# Altium schematic sheet CW_demcheva_ControlBoard_Sh2.SchDoc: =title_line_1 + title_line_2
size 840 x 594 mm; SheetNumber: 2
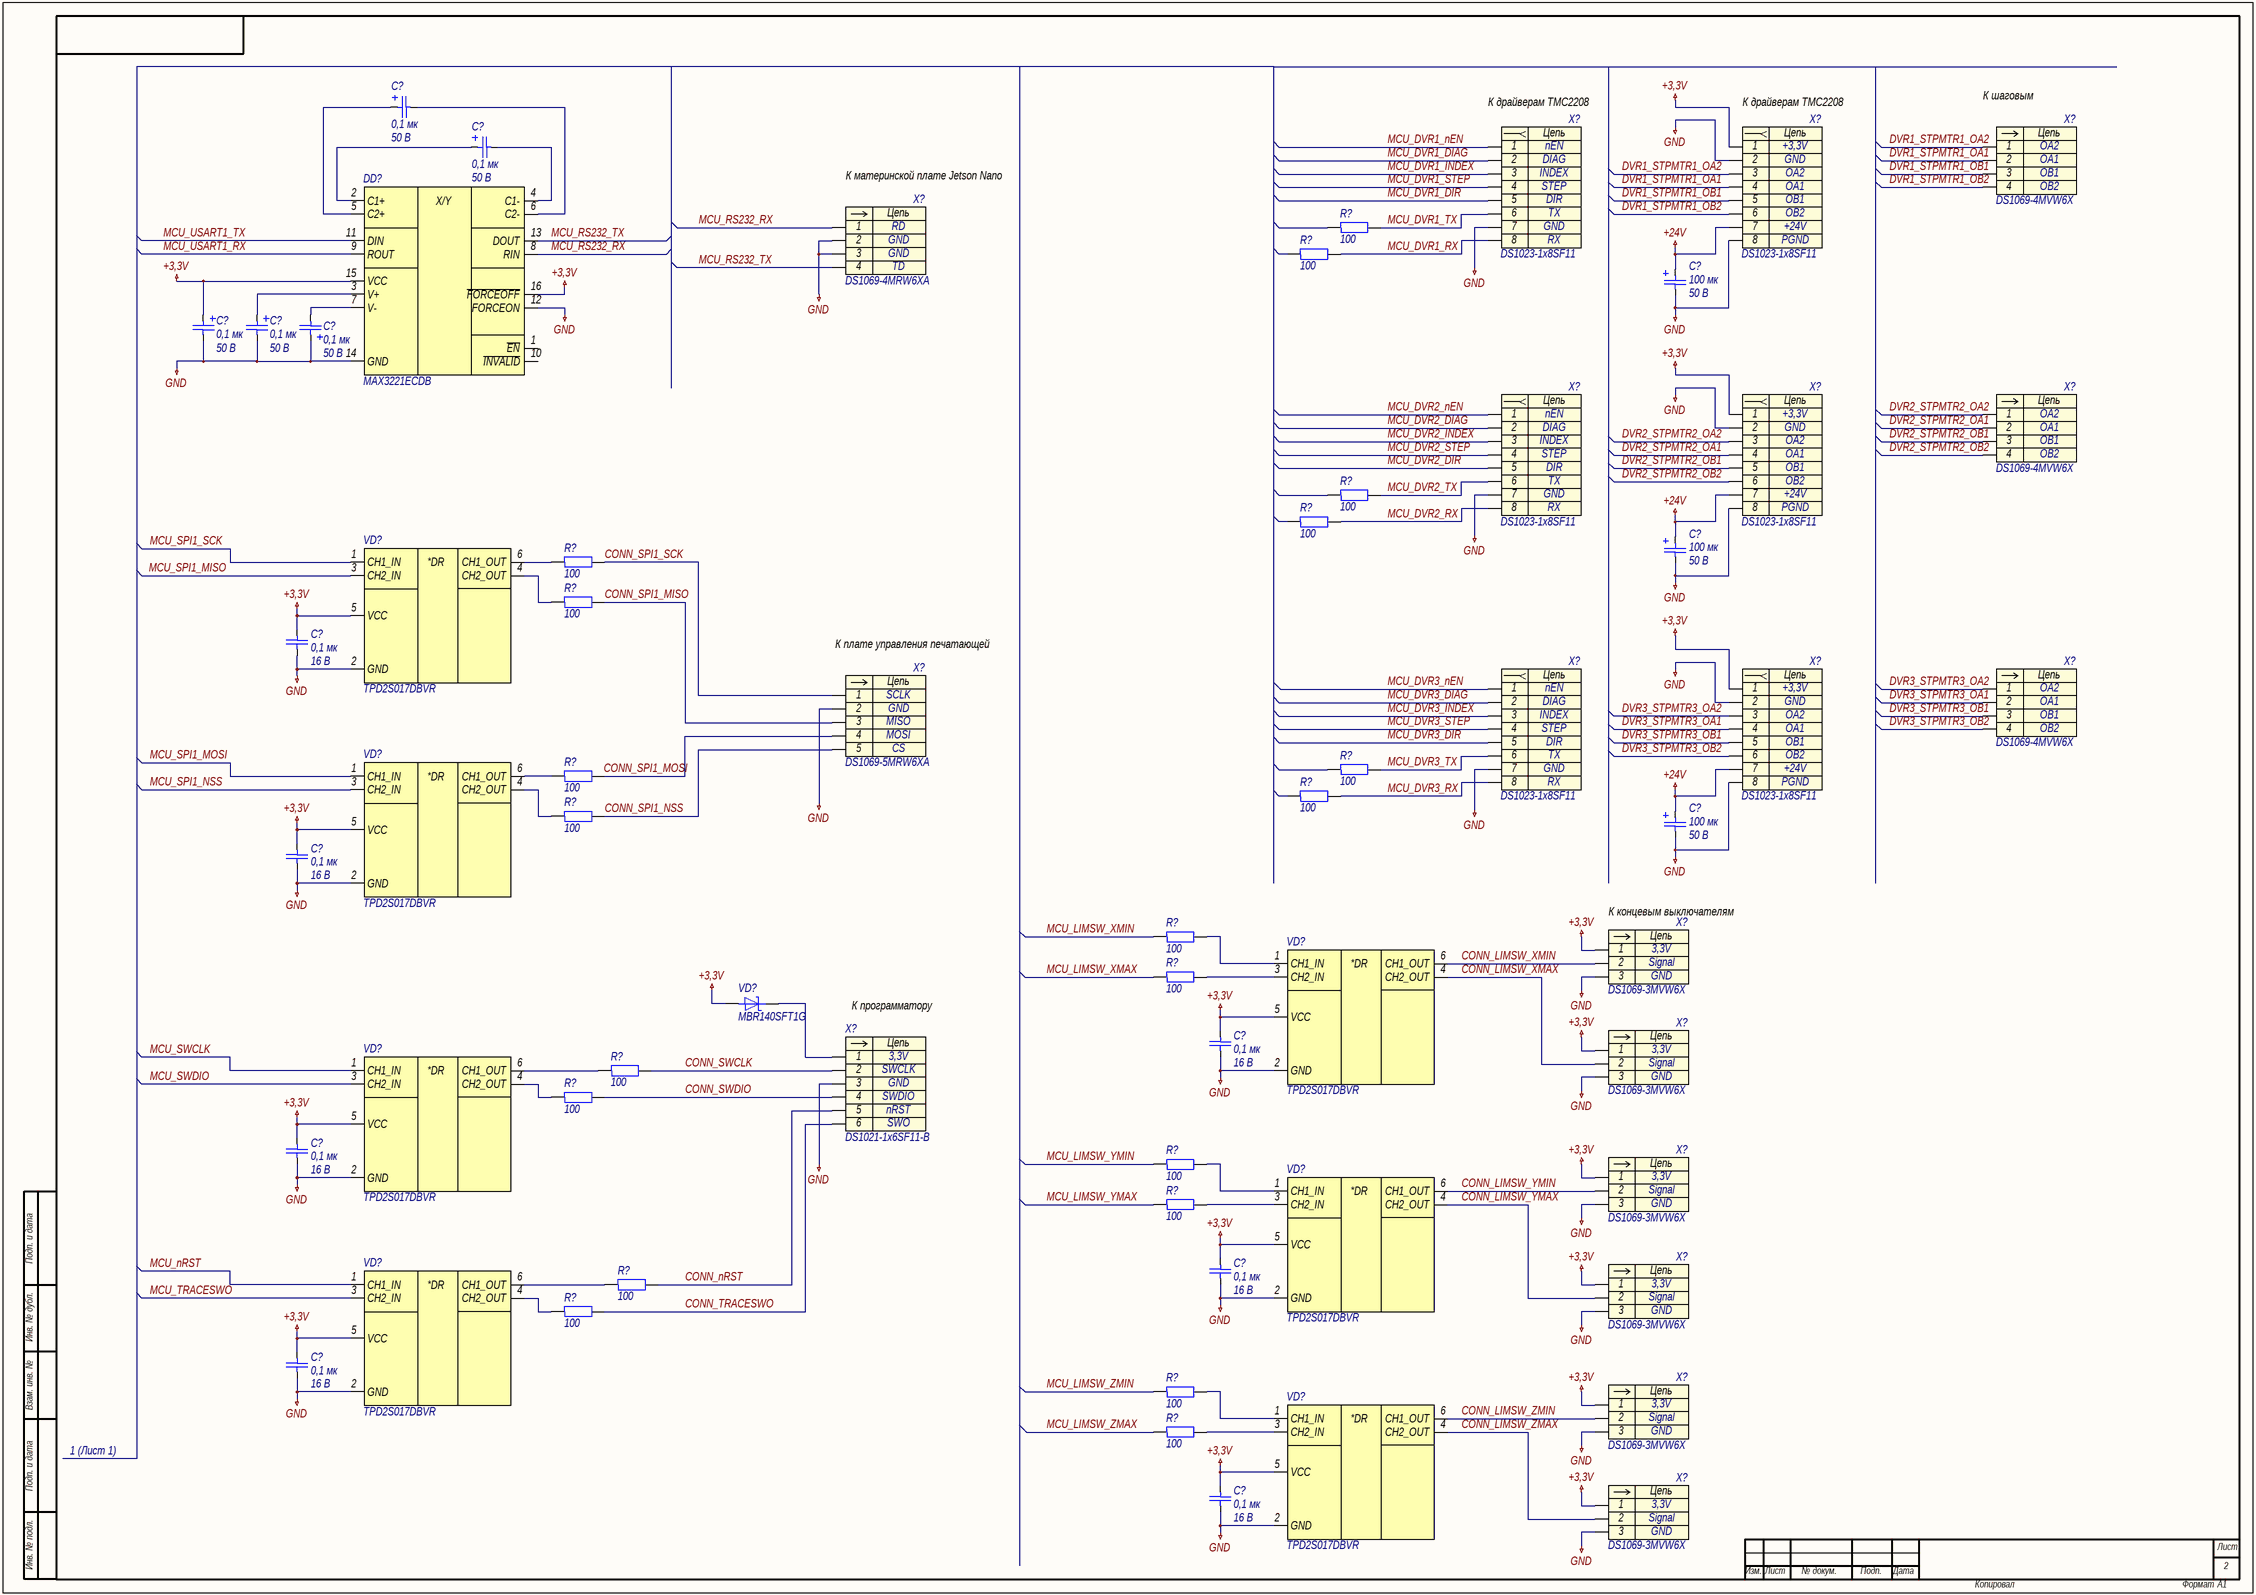
[diagram p0: CW_demcheva_ControlBoard_Sh2.SchDoc]

## Parts
(Parts that share a designator on the sheet are numbered #1, #2 ... from top to bottom, then left to right.)
C?#1  0,1 мк  Напряжение: 50 В  [C3216-18]
C?#2  0,1 мк  Напряжение: 50 В  [C3216-18]
C?#3  100 мк  Напряжение: 50 В  [CAPAE-660X660X800]
C?#4  0,1 мк  Напряжение: 50 В  [C3216-18]
C?#5  0,1 мк  Напряжение: 50 В  [C3216-18]
C?#6  0,1 мк  Напряжение: 50 В  [C3216-18]
C?#7  100 мк  Напряжение: 50 В  [CAPAE-660X660X800]
C?#8  0,1 мк  Напряжение: 16 В  [C0603]
C?#9  100 мк  Напряжение: 50 В  [CAPAE-660X660X800]
C?#10  0,1 мк  Напряжение: 16 В  [C0603]
C?#11  0,1 мк  Напряжение: 16 В  [C0603]
C?#12  0,1 мк  Напряжение: 16 В  [C0603]
C?#13  0,1 мк  Напряжение: 16 В  [C0603]
C?#14  0,1 мк  Напряжение: 16 В  [C0603]
C?#15  0,1 мк  Напряжение: 16 В  [C0603]
DD?  MAX3221ECDB  [SSOP-16-P65-620X530X200-L75X30]
R?#1  100  [R0603]
R?#2  100  [R0603]
R?#3  100  [R0603]
R?#4  100  [R0603]
R?#5  100  [R0603]
R?#6  100  [R0603]
R?#7  100  [R0603]
R?#8  100  [R0603]
R?#9  100  [R0603]
R?#10  100  [R0603]
R?#11  100  [R0603]
R?#12  100  [R0603]
R?#13  100  [R0603]
R?#14  100  [R0603]
R?#15  100  [R0603]
R?#16  100  [R0603]
R?#17  100  [R0603]
R?#18  100  [R0603]
R?#19  100  [R0603]
R?#20  100  [R0603]
VD?#1  TPD2S017DBVR  [SOT-23-6-P95-290X280X145]
VD?#2  TPD2S017DBVR  [SOT-23-6-P95-290X280X145]
VD?#3  MBR140SFT1G  [SOD-123FL-370X165X98]
VD?#4  TPD2S017DBVR  [SOT-23-6-P95-290X280X145]
VD?#5  TPD2S017DBVR  [SOT-23-6-P95-290X280X145]
VD?#6  TPD2S017DBVR  [SOT-23-6-P95-290X280X145]
VD?#7  TPD2S017DBVR  [SOT-23-6-P95-290X280X145]
VD?#8  TPD2S017DBVR  [SOT-23-6-P95-290X280X145]
X?#1  DS1069-4MVW6X  [DS1069-4MVW6X]
X?#2  DS1023-1x8SF11  [DS1023-1X8SF11]
X?#3  DS1023-1x8SF11  [DS1023-1X8SF11]
X?#4  DS1069-4MRW6XA  [DS1069-4MRW6XA]
X?#5  DS1069-4MVW6X  [DS1069-4MVW6X]
X?#6  DS1023-1x8SF11  [DS1023-1X8SF11]
X?#7  DS1023-1x8SF11  [DS1023-1X8SF11]
X?#8  DS1069-4MVW6X  [DS1069-4MVW6X]
X?#9  DS1069-5MRW6XA  [DS1069-5MRW6XA]
X?#10  DS1023-1x8SF11  [DS1023-1X8SF11]
X?#11  DS1023-1x8SF11  [DS1023-1X8SF11]
X?#12  DS1069-3MVW6X  [DS1069-3MVW6X]
X?#13  DS1069-3MVW6X  [DS1069-3MVW6X]
X?#14  DS1021-1x6SF11-B  [DS1021-1X6SF11-B]
X?#15  DS1069-3MVW6X  [DS1069-3MVW6X]
X?#16  DS1069-3MVW6X  [DS1069-3MVW6X]
X?#17  DS1069-3MVW6X  [DS1069-3MVW6X]
X?#18  DS1069-3MVW6X  [DS1069-3MVW6X]

## Nets
+3,3V: C?#5.1 C?#8.2 C?#10.2 C?#11.2 C?#12.2 C?#13.2 C?#14.2 C?#15.2 DD?.15(VCC) DD?.16(~{FORCEOFF}) VD?#1.5(VCC) VD?#2.5(VCC) VD?#3.2 VD?#4.5(VCC) VD?#5.5(VCC) VD?#6.5(VCC) VD?#7.5(VCC) VD?#8.5(VCC) X?#3.1 X?#7.1 X?#11.1 X?#12.1 X?#13.1 X?#15.1 X?#16.1 X?#17.1 X?#18.1
+24V: C?#3.1 C?#7.1 C?#9.1 X?#3.7 X?#7.7 X?#11.7
GND: C?#3.2 C?#4.1 C?#5.2 C?#6.2 C?#7.2 C?#8.1 C?#9.2 C?#10.1 C?#11.1 C?#12.1 C?#13.1 C?#14.1 C?#15.1 DD?.12(FORCEON) DD?.14(GND) VD?#1.2(GND) VD?#2.2(GND) VD?#4.2(GND) VD?#5.2(GND) VD?#6.2(GND) VD?#7.2(GND) VD?#8.2(GND) X?#2.7 X?#3.2 X?#3.8 X?#4.2 X?#4.3 X?#6.7 X?#7.2 X?#7.8 X?#9.2 X?#10.7 X?#11.2 X?#11.8 X?#12.3 X?#13.3 X?#14.3 X?#15.3 X?#16.3 X?#17.3 X?#18.3
CONN_LIMSW_XMAX: VD?#4.4(CH2_OUT) X?#13.2
CONN_LIMSW_XMIN: VD?#4.6(CH1_OUT) X?#12.2
CONN_LIMSW_YMAX: VD?#6.4(CH2_OUT) X?#16.2
CONN_LIMSW_YMIN: VD?#6.6(CH1_OUT) X?#15.2
CONN_LIMSW_ZMAX: VD?#8.4(CH2_OUT) X?#18.2
CONN_LIMSW_ZMIN: VD?#8.6(CH1_OUT) X?#17.2
CONN_nRST: R?#17.2 X?#14.5
CONN_SPI1_MISO: R?#6.2 X?#9.3
CONN_SPI1_NSS: R?#10.2 X?#9.5
CONN_SPI1_SCK: R?#5.2 X?#9.1
CONN_SWCLK: R?#13.2 X?#14.2
CONN_SWDIO: R?#14.2 X?#14.4
CONN_TRACESWO: R?#18.2 X?#14.6
DVR1_STPMTR1_OA1: X?#1.2 X?#3.4
DVR1_STPMTR1_OA2: X?#1.1 X?#3.3
DVR1_STPMTR1_OB1: X?#1.3 X?#3.5
DVR1_STPMTR1_OB2: X?#1.4 X?#3.6
DVR2_STPMTR2_OA1: X?#5.2 X?#7.4
DVR2_STPMTR2_OA2: X?#5.1 X?#7.3
DVR2_STPMTR2_OB1: X?#5.3 X?#7.5
DVR2_STPMTR2_OB2: X?#5.4 X?#7.6
DVR3_STPMTR3_OA1: X?#8.2 X?#11.4
DVR3_STPMTR3_OA2: X?#8.1 X?#11.3
DVR3_STPMTR3_OB1: X?#8.3 X?#11.5
DVR3_STPMTR3_OB2: X?#8.4 X?#11.6
MCU_DVR1_DIAG: X?#2.2
MCU_DVR1_DIR: X?#2.5
MCU_DVR1_INDEX: X?#2.3
MCU_DVR1_nEN: X?#2.1
MCU_DVR1_RX: R?#2.2 X?#2.8
MCU_DVR1_STEP: X?#2.4
MCU_DVR1_TX: R?#1.2 X?#2.6
MCU_DVR2_DIAG: X?#6.2
MCU_DVR2_DIR: X?#6.5
MCU_DVR2_INDEX: X?#6.3
MCU_DVR2_nEN: X?#6.1
MCU_DVR2_RX: R?#4.2 X?#6.8
MCU_DVR2_STEP: X?#6.4
MCU_DVR2_TX: R?#3.2 X?#6.6
MCU_DVR3_DIAG: X?#10.2
MCU_DVR3_DIR: X?#10.5
MCU_DVR3_INDEX: X?#10.3
MCU_DVR3_nEN: X?#10.1
MCU_DVR3_RX: R?#9.2 X?#10.8
MCU_DVR3_STEP: X?#10.4
MCU_DVR3_TX: R?#7.2 X?#10.6
MCU_LIMSW_XMAX: R?#12.1
MCU_LIMSW_XMIN: R?#11.1
MCU_LIMSW_YMAX: R?#16.1
MCU_LIMSW_YMIN: R?#15.1
MCU_LIMSW_ZMAX: R?#20.1
MCU_LIMSW_ZMIN: R?#19.1
MCU_nRST: VD?#7.1(CH1_IN)
MCU_RS232_RX: DD?.8(RIN) X?#4.1
MCU_RS232_TX: DD?.13(DOUT) X?#4.4
MCU_SPI1_MISO: VD?#1.3(CH2_IN)
MCU_SPI1_MOSI: VD?#2.1(CH1_IN)
MCU_SPI1_NSS: VD?#2.3(CH2_IN)
MCU_SPI1_SCK: VD?#1.1(CH1_IN)
MCU_SWCLK: VD?#5.1(CH1_IN)
MCU_SWDIO: VD?#5.3(CH2_IN)
MCU_TRACESWO: VD?#7.3(CH2_IN)
MCU_USART1_RX: DD?.9(ROUT)
MCU_USART1_TX: DD?.11(DIN)
NetC?#1_1: C?#1.1 DD?.5(C2+)
NetC?#1_2: C?#1.2 DD?.6(C2-)
NetC?#2_1: C?#2.1 DD?.2(C1+)
NetC?#2_2: C?#2.2 DD?.4(C1-)
NetC?#4_2: C?#4.2 DD?.7(V-)
NetC?#6_1: C?#6.1 DD?.3(V+)
NetR?#5_1: R?#5.1 VD?#1.6(CH1_OUT)
NetR?#6_1: R?#6.1 VD?#1.4(CH2_OUT)
NetR?#8_1: R?#8.1 VD?#2.6(CH1_OUT)
NetR?#8_2: R?#8.2 X?#9.4
NetR?#10_1: R?#10.1 VD?#2.4(CH2_OUT)
NetR?#11_2: R?#11.2 VD?#4.1(CH1_IN)
NetR?#12_2: R?#12.2 VD?#4.3(CH2_IN)
NetR?#13_1: R?#13.1 VD?#5.6(CH1_OUT)
NetR?#14_1: R?#14.1 VD?#5.4(CH2_OUT)
NetR?#15_2: R?#15.2 VD?#6.1(CH1_IN)
NetR?#16_2: R?#16.2 VD?#6.3(CH2_IN)
NetR?#17_1: R?#17.1 VD?#7.6(CH1_OUT)
NetR?#18_1: R?#18.1 VD?#7.4(CH2_OUT)
NetR?#19_2: R?#19.2 VD?#8.1(CH1_IN)
NetR?#20_2: R?#20.2 VD?#8.3(CH2_IN)
NetVD?#3_1: VD?#3.1 X?#14.1

Not connected (* = marked no-connect by the designer): DD? 1(~{EN}) 10(~{INVALID}); R?#1 1; R?#2 1; R?#3 1; R?#4 1; R?#7 1; R?#9 1

## Notes on the sheet
- К драйверам TMC2208
- К шаговым двигателям
- К материнской плате Jetson Nano
- К плате управления печатающей головы
- (near X?#12) К концевым выключателям
- К программатору
- 1 (Лист 1)
- Labels drawn without touching a wire or pin: CONN_SPI1_MOSI
- Подп. и дата
- Инв. № дубл.
- Взам. инв. №
- Инв. № подл.
- Лист
- Изм.
- № докум.
- Подп.
- Дата
- Копировал
- Формат
- А1
- (in symbol dd0015) X/Y
- (in symbol vd0016) *DR
- (in symbol x0023) Цепь
- (in symbol x0036) Цепь
- (in symbol x0043) Цепь
- (in symbol x0044) Цепь
- (in symbol x0045) Цепь
- (in symbol x0046) Цепь

## Library data of the parts
C?#1 C?#2 C?#4-C?#6 = c0001: =Описание; ID: c0001; Фамилия: Ларионов; Описание: Конденсатор танталовый чип 3216-18 100 нФ 50 В ±10 %; Наименование: 293D104X9050A2TE3; Производитель: Vishay Intertechnology, Inc.; Отклонение: ±10 %; Эквивалентное последовательное сопротивление: 19,0 Ом; Среднеквадратичный размах пульсации тока: 0,06 А; Рабочие температуры: от –55 °С до +125 °С; Корпус: 3216-18; Номинал: 0,1 мк; Номинальное напряжение: 50 В; HelpURL: https://www.vishay.com/capacitors/list/product-40002/
C?#3 C?#7 C?#9 = c0168: =Описание; ID: c0168; Фамилия: Паньков; Описание: Конденсатор электролитический алюминиевый 100 мкФ 50 В ±20 %; Наименование: EEEFTH101XAP; Производитель: Panasonic Corporation; Отклонение: ±20 %; Эквивалентное последовательное сопротивление: 0,34 Ом; Среднеквадратичный размах пульсации тока: 0,35 А; Рабочие температуры: от –55 °С до +105 °С; Корпус: CAPAE (6,6 x 6,6 x 8,0); Номинал: 100 мк; Номинальное напряжение: 50 В; HelpURL: https://industrial.panasonic.com/ww/products/capacitors/aluminum-capacitors/aluminum-cap-smd/models/EEEFTH101XAP
C?#8 C?#10-C?#15 = c0063: =Описание; ID: c0063; Фамилия: Паньков; Описание: Конденсатор керамический чип 0603 100 нФ 16 В ±10 %; Наименование: CC0603KRX7R7BB104; Производитель: YAGEO Corp.; Отклонение: ±10 %; Рабочие температуры: от –55 °С до +125 °С; Температурный коэффициент емкости: X7R; Корпус: 0603; Номинал: 0,1 мк; Номинальное напряжение: 16 В; HelpURL: https://www.yageo.com/upload/media/product/productsearch/datasheet/mlcc/UPY-GPHC_X7R_6.3V-to-50V_20.pdf
DD? = dd0015: =Описание; ID: dd0015; Фамилия: Шкабара; Описание: Приемопередатчик RS-232; Производитель: Texas Instruments Inc.; Рабочие температуры: от 0 до +70 °C; Корпус: SSOP-16; Наименование: MAX3221ECDB; HelpURL: https://www.ti.com/product/MAX3221E
R?#1-R?#20 = r0052: =Описание; ID: r0052; Фамилия: Самарин; Описание: Резистор чип 0603 100 Ом ±1 % 0,1 Вт; Наименование: RC0603FR‍‐07100RL; Производитель: YAGEO Corp.; Отклонение: ±1 %; Номинальное напряжение: 75 В; Номинальный ток: 1 А; Рабочие температуры: от –55 °С до +155 °С; Корпус: 0603; Примечание: Ряд E24; Номинал: 100; HelpURL: https://www.yageo.com/upload/media/product/productsearch/datasheet/rchip/PYu-RC_Group_51_RoHS_L_11.pdf
VD?#1 VD?#2 VD?#4-VD?#8 = vd0016: =Описание; ID: vd0016; Фамилия: Паньков; Описание: Диодная сборка для подавления помех 5 В; Производитель: Texas Instruments Inc.; Корпус: SOT-23-6; Наименование: TPD2S017DBVR; HelpURL: https://www.ti.com/product/TPD2S017
VD?#3 = vd0002: =Описание; ID: vd0002; Фамилия: Паньков; Описание: Диод Шоттки 40 В 1 А; Производитель: ON Semiconductor; Максимальное прямое напряжение: 0,88 В; Максимальное обратное напряжение: 40 В; Максимальный прямой ток: 1 А; Рабочие температуры: от –55 °С до +125 °С; Корпус: SOD-123FL; Наименование: MBR140SFT1G; HelpURL: https://www.onsemi.com/products/discretes-drivers/diodes-rectifiers/schottky-diodes-schottky-rectifiers/mbr140sf
X?#1 X?#5 X?#8 = x0045: =Описание; Contact_1: OA2; Contact_2: OA1; Contact_3: OB1; Contact_4: OB2; ID: x0045; Фамилия: Паньков; Описание: CWF 4 pin 2,5 мм вилка прямой; Производитель: Connfly Electronic Co., Ltd.; Наименование: DS1069-4MVW6X; HelpURL: http://en.connfly.group/product/xVkr=EusQssAN0gN=Aos=mU+UrVkR9kqEAN0gN0MUR+g+NB+A
X?#2 X?#6 X?#10 = x0036: =Описание; Contact_1: nEN; Contact_2: DIAG; Contact_3: INDEX; Contact_4: STEP; Contact_5: DIR; Contact_6: TX; Contact_7: GND; Contact_8: RX; ID: x0036; Фамилия: Паньков; Описание: PBS 8 pin 2,54 мм гнездо прямой; Производитель: Connfly Electronic Co., Ltd.; Наименование: DS1023-1x8SF11; HelpURL: http://en.connfly.group/product/xVkr=EusQssAN0gN=Aos=mU+UrVkR9kqEAN0gN0AUCUNB+A
X?#3 X?#7 X?#11 = x0036: =Описание; Contact_1: +3,3V; Contact_2: GND; Contact_3: OA2; Contact_4: OA1; Contact_5: OB1; Contact_6: OB2; Contact_7: +24V; Contact_8: PGND; ID: x0036; Фамилия: Паньков; Описание: PBS 8 pin 2,54 мм гнездо прямой; Производитель: Connfly Electronic Co., Ltd.; Наименование: DS1023-1x8SF11; HelpURL: http://en.connfly.group/product/xVkr=EusQssAN0gN=Aos=mU+UrVkR9kqEAN0gN0AUCUNB+A
X?#4 = x0044: =Описание; Contact_1: RD; Contact_2: GND; Contact_4: TD; ID: x0044; Фамилия: Паньков; Описание: CWF 4 pin Type A 2,5 мм вилка угловой; Производитель: Connfly Electronic Co., Ltd.; Contact_3: GND; Наименование: DS1069-4MRW6XA; HelpURL: http://en.connfly.group/product/xVkr=EusQssAN0gN=Aos=mU+UrVkR9kqEAN0gN0MUR+g+NB+A
X?#9 = x0046: =Описание; Contact_1: SCLK; Contact_2: GND; Contact_3: MISO; Contact_4: MOSI; Contact_5: CS; ID: x0046; Фамилия: Паньков; Описание: CWF 5 pin Type A 2,5 мм вилка угловой; Производитель: Connfly Electronic Co., Ltd.; Наименование: DS1069-5MRW6XA; HelpURL: http://en.connfly.group/product/xVkr=EusQssAN0gN=Aos=mU+UrVkR9kqEAN0gN0MUR+g+NB+A
X?#12 X?#13 X?#15-X?#18 = x0043: =Описание; Contact_1: 3,3V; Contact_2: Signal; Contact_3: GND; ID: x0043; Фамилия: Паньков; Описание: CWF 3 pin 2,5 мм вилка прямой; Производитель: Connfly Electronic Co., Ltd.; Наименование: DS1069-3MVW6X; HelpURL: http://en.connfly.group/product/xVkr=EusQssAN0gN=Aos=mU+UrVkR9kqEAN0gN0MUR+g+NB+A
X?#14 = x0023: =Описание; Contact_1: 3,3V; Contact_2: SWCLK; Contact_3: GND; Contact_4: SWDIO; Contact_5: nRST; Contact_6: SWO; ID: x0023; Фамилия: Паньков; Описание: PLS 6 pin 2,54 мм вилка прямой; Производитель: Connfly Electronic Co., Ltd.; Наименование: DS1021-1x6SF11-B; HelpURL: http://en.connfly.group/product/xVkr=EusQssAN0gN=Aos=mU+UrVkR9kqEAN0gN9g+WqANB+A